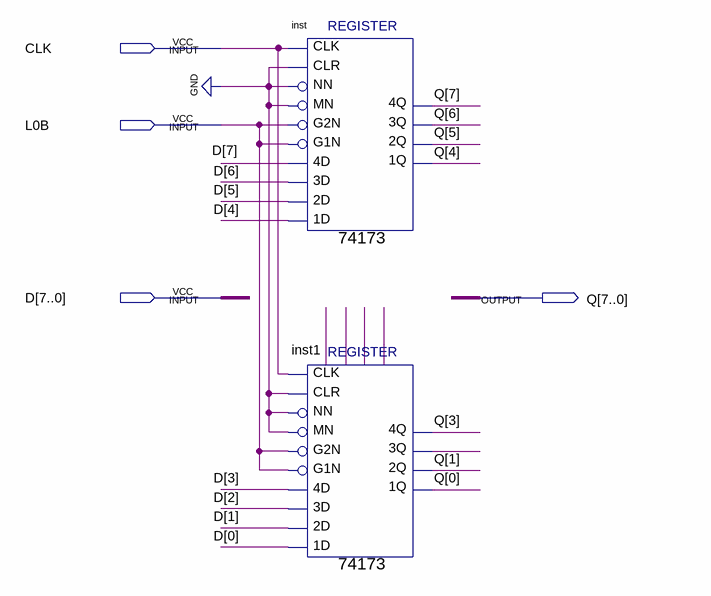
[diagram p0: schematic sheet]
// Quartus schematic Registrador_de_Saida.bdf as structural Verilog: 2 symbols, 4 pins
module Registrador_de_Saida (
  input  CLK,
  input  L0B,
  input  [7:0] D,
  output [7:0] Q
);

  wire inst1_3q;

  \74173  inst (
    .\3D (D[6]), .MN(1'b0), .\1D (D[4]), .\2D (D[5]), .\4D (D[7]), .G1N(L0B), .G2N(L0B), .NN(1'b0),
    .CLR(1'b0), .CLK(CLK), .\3Q (Q[6]), .\2Q (Q[5]), .\1Q (Q[4]), .\4Q (Q[7]));
  \74173  inst1 (
    .\3D (D[2]), .MN(1'b0), .\1D (D[0]), .\2D (D[1]), .\4D (D[3]), .G1N(L0B), .G2N(L0B), .NN(1'b0),
    .CLR(1'b0), .CLK(CLK), .\3Q (inst1_3q), .\2Q (Q[1]), .\1Q (Q[0]), .\4Q (Q[3]));
endmodule
